# EAGLE design TXV2 (EAGLE 7.3.0)
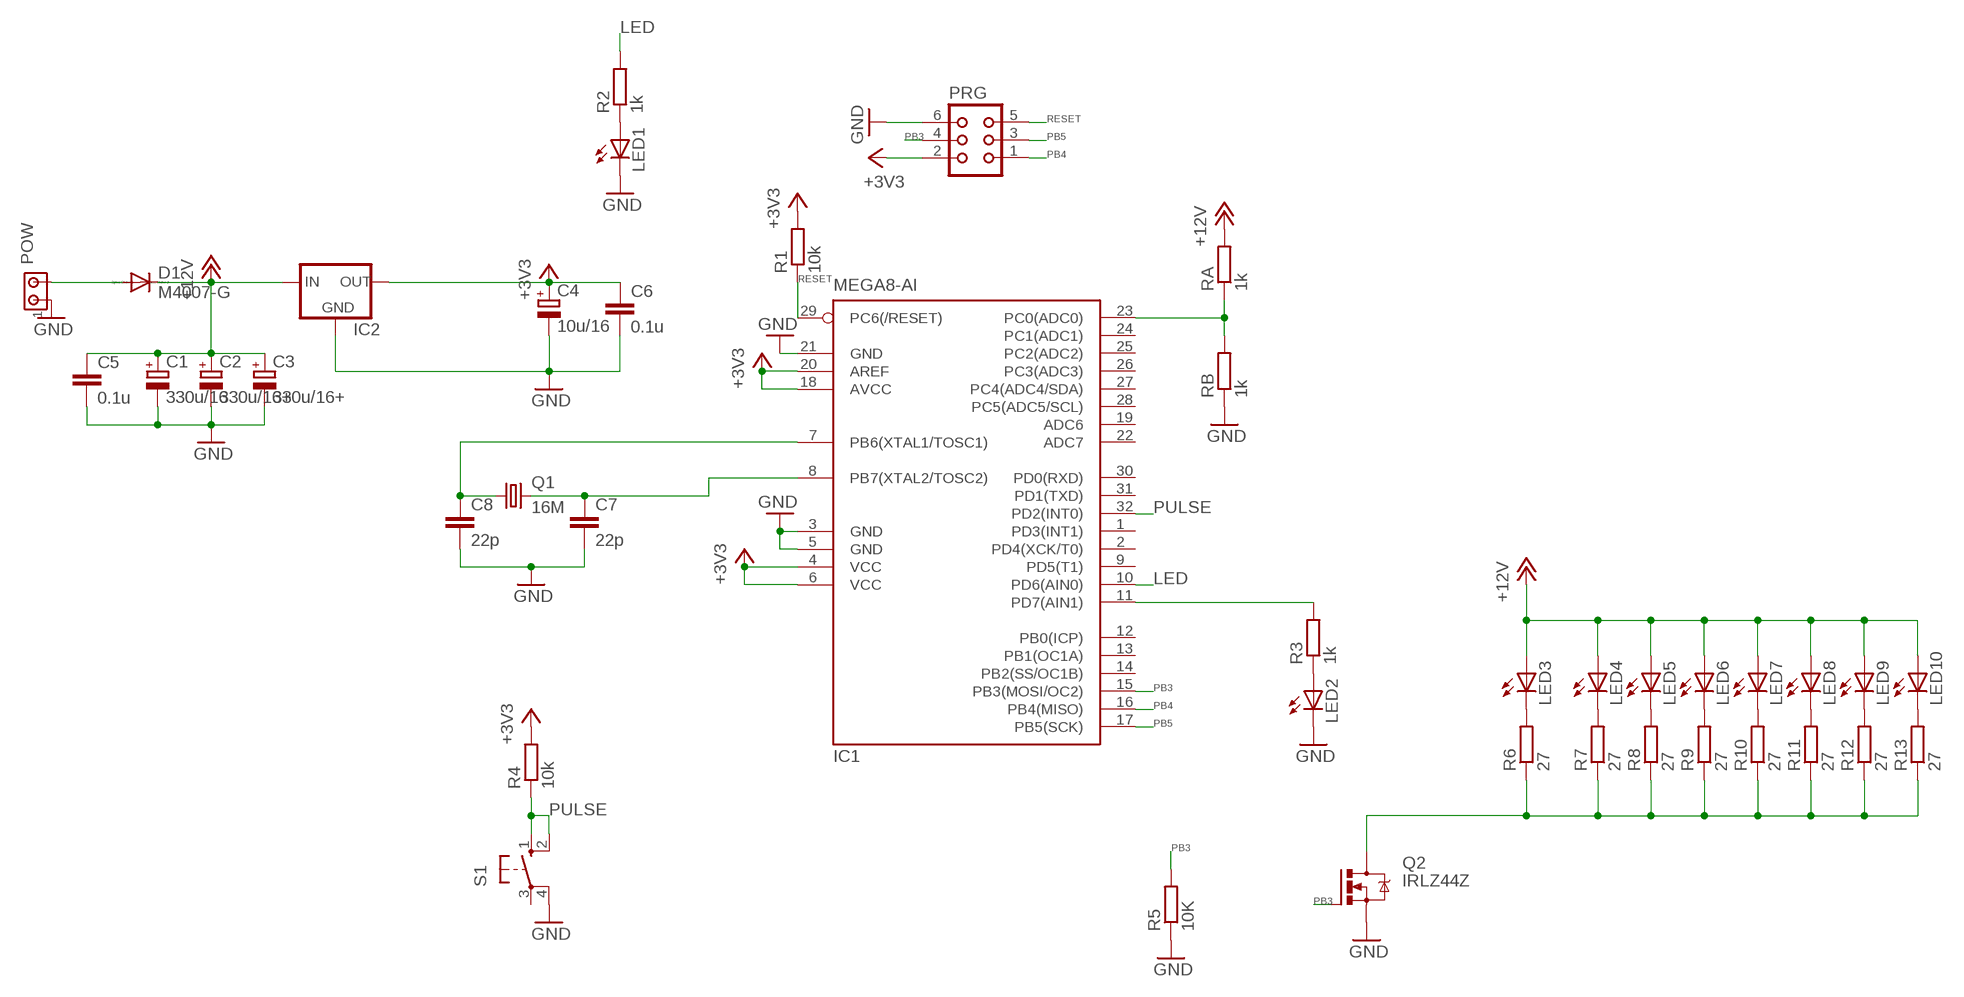
[diagram p0: schematic, sheet 1]

## Parts
C1  330u/16  CPOL-EUE2.5-7  [E2,5-7]
C2  330u/16+  CPOL-EUE2.5-7  [E2,5-7]
C3  330u/16+  CPOL-EUE2.5-7  [E2,5-7]
C4  10u/16  CPOL-EUE2.5-6  [E2,5-6]
C5  0.1u  C-EUC0402  [C0402]
C6  0.1u  C-EUC0402  [C0402]
C7  22p  C-EUC0805  [C0805]
C8  22p  C-EUC0805  [C0805]
D1  M4007-G  CGRM4007-G  [SOD-123_MINI-SMA]
IC1  MEGA8-AI  [TQFP32-08]
IC2  78LXX  [78LXX]
LED1  LED5MM  [LED5MM]
LED2  LED5MM  [LED5MM]
LED3  LED5MM  [LED5MM]
LED4  LED5MM  [LED5MM]
LED5  LED5MM  [LED5MM]
LED6  LED5MM  [LED5MM]
LED7  LED5MM  [LED5MM]
LED8  LED5MM  [LED5MM]
LED9  LED5MM  [LED5MM]
LED10  LED5MM  [LED5MM]
POW  MTA02-100  [10X02MTA]
PRG  CON06  [CON06]
Q1  16M  CRYSTALHC49UP  [HC49UP]
Q2  IRLZ44Z  [TO220BH]
R1  10k  R-EU_M1206  [M1206]
R2  1k  R-EU_M1206  [M1206]
R3  1k  R-EU_M1206  [M1206]
R4  10k  R-EU_M1206  [M1206]
R5  10K  R-EU_M1206  [M1206]
R6  27  R-EU_0204/7  [0204/7]
R7  27  R-EU_0204/7  [0204/7]
R8  27  R-EU_0204/7  [0204/7]
R9  27  R-EU_0204/7  [0204/7]
R10  27  R-EU_0204/7  [0204/7]
R11  27  R-EU_0204/7  [0204/7]
R12  27  R-EU_0204/7  [0204/7]
R13  27  R-EU_0204/7  [0204/7]
RA  1k  R-EU_M1206  [M1206]
RB  1k  R-EU_M1206  [M1206]
S1  10-XX  [B3F-10XX]

## Nets
+3V3: C4.+ C6.1 IC1.4(VCC) IC1.6(VCC) IC1.18(AVCC) IC1.20(AREF) IC2.OUT PRG.2 R1.2 R4.2
+12V: C1.+ C2.+ C3.+ C5.1 D1.C IC2.IN LED3.A LED4.A LED5.A LED6.A LED7.A LED8.A LED9.A LED10.A RA.2
GND: C1.- C2.- C3.- C4.- C5.2 C6.2 C7.2 C8.2 IC1.3(GND) IC1.5(GND) IC1.21(GND) IC2.GND LED1.K(C) LED2.K(C) POW.1 PRG.6 Q2.S R5.1 RB.1 S1.4(P1)
LED: IC1.10(PD6(AIN0)) R2.2
N$1: LED3.K(C) R6.2
N$2: LED1.A R2.1
N$3: IC1.11(PD7(AIN1)) R3.2
N$4: LED2.A R3.1
N$5: LED4.K(C) R7.2
N$6: C8.1 IC1.7(PB6(XTAL1/TOSC1)) Q1.1
N$7: C7.1 IC1.8(PB7(XTAL2/TOSC2)) Q1.2
N$8: LED5.K(C) R8.2
N$9: LED6.K(C) R9.2
N$10: LED7.K(C) R10.2
N$11: LED8.K(C) R11.2
N$12: LED9.K(C) R12.2
N$13: LED10.K(C) R13.2
N$14: IC1.23(PC0(ADC0)) RA.1 RB.2
N$15: Q2.D R6.1 R7.1 R8.1 R9.1 R10.1 R11.1 R12.1 R13.1
N$16: D1.A POW.2
PB3: IC1.15(PB3(MOSI/OC2)) PRG.4 Q2.G R5.2
PB4: IC1.16(PB4(MISO)) PRG.1
PB5: IC1.17(PB5(SCK)) PRG.3
PULSE: IC1.32(PD2(INT0)) R4.1 S1.1(S) S1.2(S1)
RESET: IC1.29(PC6(/RESET)) PRG.5 R1.1
Unconnected: IC1.1(PD3(INT1)) IC1.2(PD4(XCK/T0)) IC1.9(PD5(T1)) IC1.12(PB0(ICP)) IC1.13(PB1(OC1A)) IC1.14(PB2(SS/OC1B)) IC1.19(ADC6) IC1.22(ADC7) IC1.24(PC1(ADC1)) IC1.25(PC2(ADC2)) IC1.26(PC3(ADC3)) IC1.27(PC4(ADC4/SDA)) IC1.28(PC5(ADC5/SCL)) IC1.30(PD0(RXD)) IC1.31(PD1(TXD)) S1.3(P)

## Library data of the parts
C1-C4 = rcl:CPOL-EU: POLARIZED CAPACITOR, European symbol
C5-C8 = rcl:C-EU: CAPACITOR, European symbol
D1 = diode:CGRM400*-G: Molded plasitc,JEDEC SOD-123/Mini SMA Source: Comchip CGRM4001-G.pdf
IC1 = atmel:MEGA8: MICROCONTROLLER 8 Kbytes FLASH, 1 kbytes SRAM, 512 bytes EEPROM, USART, 6-channel 10 bit ADC, 2-channel 8 bit ADC Pin compatible with Atmega48, ATMega88, ATMega168 Source: avr.lbr; MPN: ATMEGA8-16AU; OC_FARNELL: 9171371; OC_NEWARK: 73M8863
IC2 = v-reg:78LXX: VOLTAGE REGULATOR
LED1-LED10 = led:LED: LED OSRAM: - CHIPLED LG R971, LG N971, LY N971, LG Q971, LY Q971, LO R971, LY R971 LH N974, LH R974 LS Q976, LO Q976, LY Q976 LO Q996 - Hyper CHIPLED LW Q18S LB Q993, LB Q99A, LB R99A - SideLED LS A670, LO A670, LY A670, LG A670, LP A670 LB A673, LV A673, LT A673, LW A673 LH A674 LY A675 LS A676, LA A676, LO A676, LY A676, LW A676 LS A679, LY A679, LG A679 - Hyper Micro SIDELED® LS Y876, LA Y876, LO Y876, LY Y876 LT Y87S - SmartLED LW L88C, LW L88S LB L89C, LB L89S, LG L890 LS L89K, LO L89K, LY L89K LS L896, LA L896, LO L896, LY L896 - TOPLED LS T670, LO T670, LY T670, LG T670, LP T670 LSG T670, LSP T670, LSY T670, LOP T670, LYG T670 LG T671, LOG T671, LSG T671 LB T673, LV T673, LT T673, LW T673 LH T674 LS T676, LA T676, LO T676, LY T676, LB T676, LH T676, LSB T676, LW T676 LB T67C, LV T67C, LT T67C, LS T67K, LO T67K, LY T67K, LW E67C LS E67B, LA E67B, LO E67B, LY E67B, LB E67C, LV E67C, LT E67C LW T67C LS T679, LY T679, LG T679 LS T770, LO T770, LY T770, LG T770, LP T770 LB T773, LV T773, LT T773, LW T773 LH T774 LS E675, LA E675, LY E675, LS T675 LS T776, LA T776, LO T776, LY T776, LB T776 LHGB T686 LT T68C, LB T68C - Hyper Mini TOPLED® LB M676 - Mini TOPLED Santana® LG M470 LS M47K, LO M47K, LY M47K Source: http://www.osram.convergy.de LUXEON: - LUMILED® LXK2-PW12-R00, LXK2-PW12-S00, LXK2-PW14-U00, LXK2-PW14-V00 LXK2-PM12-R00, LXK2-PM12-S00, LXK2-PM14-U00 LXK2-PE12-Q00, LXK2-PE12-R00, LXK2-PE12-S00, LXK2-PE14-T00, LXK2-PE14-U00 LXK2-PB12-K00, LXK2-PB12-L00, LXK2-PB12-M00, LXK2-PB14-N00, LXK2-PB14-P00, LXK2-PB14-Q00 LXK2-PR12-L00, LXK2-PR12-M00, LXK2-PR14-Q00, LXK2-PR14-R00 LXK2-PD12-Q00, LXK2-PD12-R00, LXK2-PD12-S00 LXK2-PH12-R00, LXK2-PH12-S00 LXK2-PL12-P00, LXK2-PL12-Q00, LXK2-PL12-R00 Source: www.luxeon.com KINGBRIGHT: KA-3528ASYC Source: www.kingbright.com
POW = con-amp:MTA02-100: AMP connector
PRG = con-harting:CON06: CONNECTOR; OC_FARNELL: unknown; OC_NEWARK: unknown
Q1 = crystal:CRYSTAL: CRYSTAL; OC_FARNELL: unknown; OC_NEWARK: unknown
Q2 = transistor-power:IRLZ44Z: N-Channel HEXFET® Power MOSFET Logic Level AUTOMOTIVE MOSFET Source: http://www.irf.com/product-info/datasheets/data/irlz44zpbf.pdf
R1-R13 RA RB = rcl:R-EU_: RESISTOR, European symbol
S1 = switch-omron:10-XX: OMRON SWITCH; MPN: B3F-1000; OC_FARNELL: 176432; OC_NEWARK: 36M3542

## Board
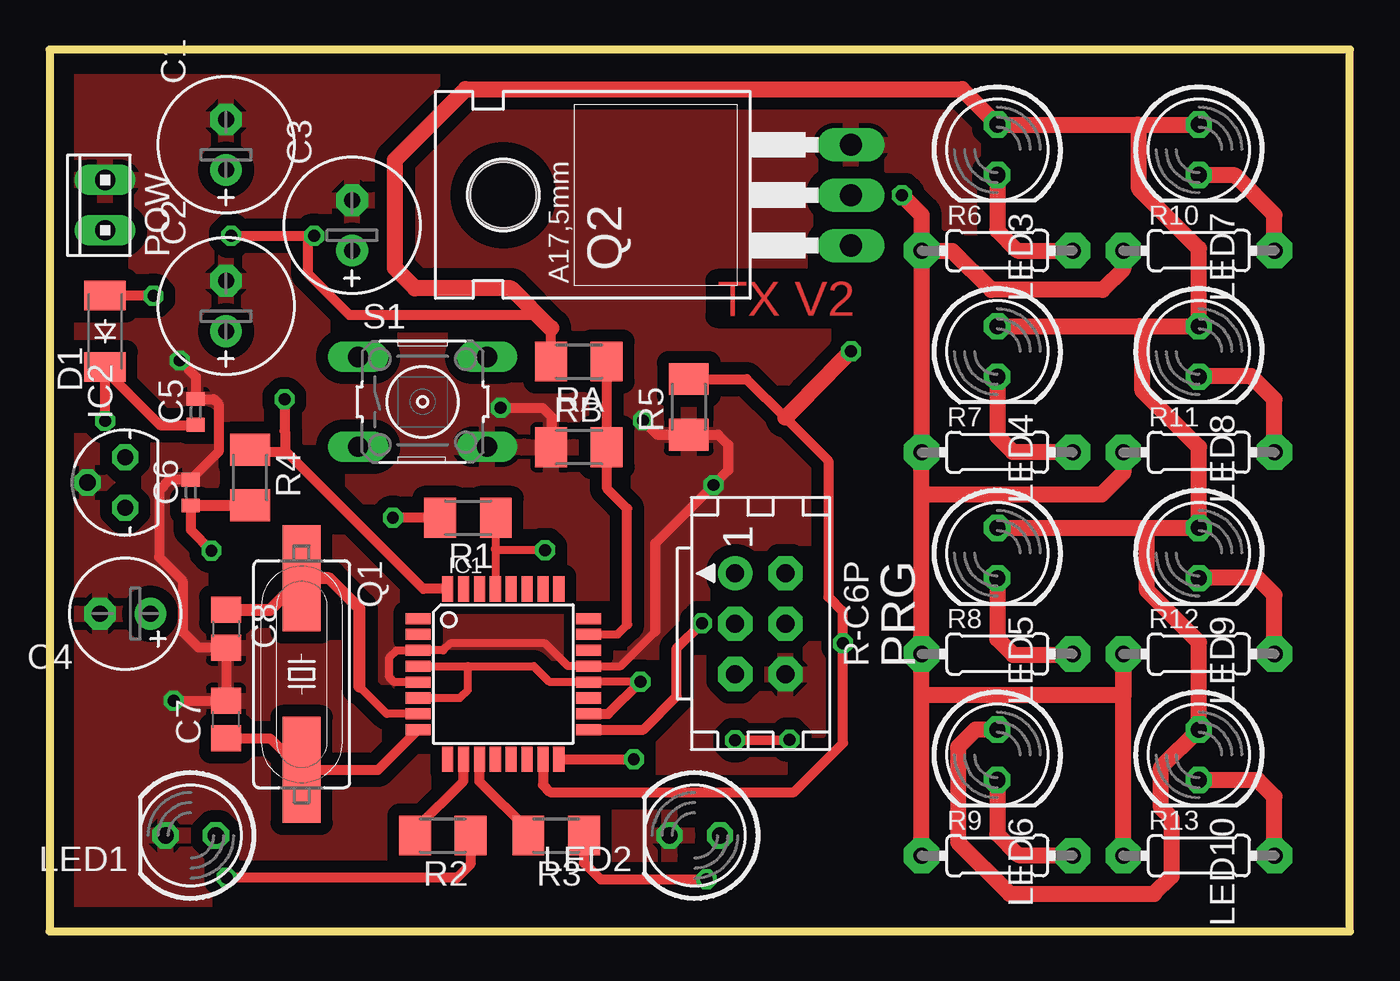
[diagram p1: board, top side]
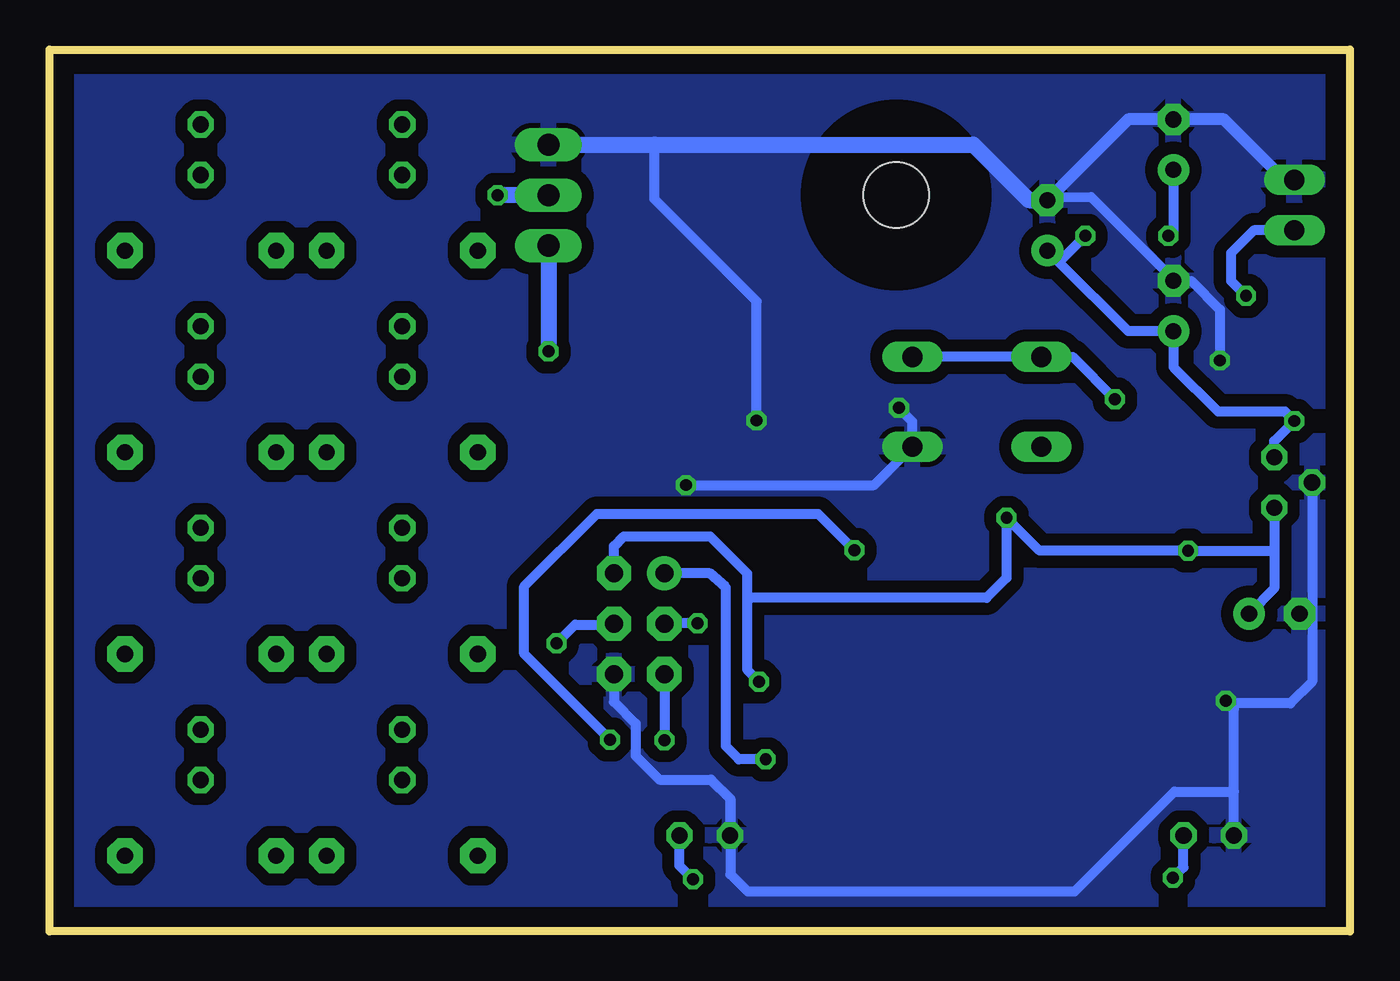
[diagram p2: board, bottom side, seen from below]

Size 65.52 x 44.41 mm. Coordinates in mm from the lower left corner, seen from the top.
Outline: 0,0 65.52,0 65.52,44.41 0,44.41 0,0
Copper layers (1*16): Top 0.035mm / dielectric 1.5mm / Bottom 0.035mm
Design rules "default": minimum track width 10mil, minimum drill 24mil, track to track 8mil, track to pad 8mil, pad to pad 8mil, via to via 8mil, smd to smd 8mil, copper to edge 40mil, drill to drill 8mil, minimum pad ring 10mil, minimum via ring 8mil, stop-mask expansion 4mil, vias tented up to drill 0mil, thermal gap 10mil

### Footprints (pad centres in the part's own frame; a part is rotated, then mirrored left to right if it is on the bottom)
E2,5-7 = drill 0.813 pad 1.6: + -1.27,0 | drill 0.813 pad 1.6 octagon: - 1.27,0
E2,5-6 = drill 0.813 pad 1.6: + -1.27,0 | drill 0.813 pad 1.6 octagon: - 1.27,0
C0402 = smd 0.7 x 0.9: 1 -0.65,0; 2 0.65,0
C0805 = smd 1.3 x 1.5: 1 -0.95,0; 2 0.95,0
SOD-123_MINI-SMA = smd 1.5 x 2.1: A 1.8,0; C -1.8,0
TQFP32-08 = smd 1.27 x 0.559: 1 -4.293,2.8; 2 -4.293,2; 3 -4.293,1.2; 4 -4.293,0.4; 5 -4.293,-0.4; 6 -4.293,-1.2; 7 -4.293,-2; 8 -4.293,-2.8; 17 4.293,-2.8; 18 4.293,-2; 19 4.293,-1.2; 20 4.293,-0.4; 21 4.293,0.4; 22 4.293,1.2; 23 4.293,2; 24 4.293,2.8 | smd 0.559 x 1.27: 9 -2.8,-4.293; 10 -2,-4.293; 11 -1.2,-4.293; 12 -0.4,-4.293; 13 0.4,-4.293; 14 1.2,-4.293; 15 2,-4.293; 16 2.8,-4.293; 25 2.8,4.293; 26 2,4.293; 27 1.2,4.293; 28 0.4,4.293; 29 -0.4,4.293; 30 -1.2,4.293; 31 -2,4.293; 32 -2.8,4.293
78LXX = drill 0.813 octagon: GND 0,1.905; IN 1.27,0; OUT -1.27,0
LED5MM = drill 0.813 octagon: A -1.27,0; K 1.27,0
10X02MTA = drill 1.016 long: 1 1.27,0; 2 -1.27,0
CON06 = drill 0.914 pad 1.727: 1 -2.54,-1.27 | drill 0.914 pad 1.727 octagon: 2 -2.54,1.27; 3 0,-1.27; 4 0,1.27; 5 2.54,-1.27; 6 2.54,1.27
HC49UP = smd 5.334 x 1.93: 1 -4.826,0; 2 4.826,0
TO220BH = drill 1.118 long: D 0,-6.35; G -2.54,-6.35; S 2.54,-6.35 | hole 3.302: 0,11.176
M1206 = smd 1.6 x 2: 1 -1.4,0; 2 1.4,0
0204/7 = drill 0.813 pad 1.778 octagon: 1 -3.81,0; 2 3.81,0
B3F-10XX = drill 1.016 long: 1 -3.251,2.261; 2 3.251,2.261; 3 -3.251,-2.261; 4 3.251,-2.261

### Placement (x,y rotation side)
C1  8.89,39.62 90 top
C2  8.89,31.5 90 top
C3  15.24,35.56 90 top
C4  3.81,16 180 top
C5  7.37,26.16 90 top
C6  7.11,22.1 90 top
C7  8.89,10.67 90 top
C8  8.89,15.24 270 top
D1  2.79,30.23 90 top
IC1  22.86,12.95 0 top
IC2  3.81,22.61 90 top
LED1  7.11,4.83 180 top
LED2  32.51,4.83 180 top
LED3  47.75,39.37 270 top
LED4  47.75,29.21 270 top
LED5  47.75,19.05 270 top
LED6  47.75,8.89 270 top
LED7  57.91,39.37 270 top
LED8  57.91,29.21 270 top
LED9  57.91,19.05 270 top
LED10  57.91,8.89 270 top
POW  2.79,36.58 90 top
PRG  35.81,15.49 270 top
Q1  12.7,12.95 270 top
Q2  34.04,37.08 90 top
R1  21.08,20.83 180 top
R2  19.81,4.83 180 top
R3  25.53,4.83 180 top
R4  10.11,22.86 270 top
R5  32.21,26.42 90 top
R6  47.75,34.29 0 top
R7  47.75,24.13 0 top
R8  47.75,13.97 0 top
R9  47.75,3.81 0 top
R10  57.91,34.29 0 top
R11  57.91,24.13 0 top
R12  57.91,13.97 0 top
R13  57.91,3.81 0 top
RA  26.67,28.7 180 top
RB  26.67,24.38 0 top
S1  18.8,26.67 0 top

### Tracks (layer width: path | path; a pad name or v marks a point on that pad's centre or on a via)
+3V3  (via drill 0.6)
  Top 0.406: v29.77,12.57 27.17,12.57 | IC1.4 21.08,13.35 | 21.08,13.35 24.39,13.35 25.17,12.57 27.13,12.57 | IC1.6 20.67,11.75 21.08,12.17 21.08,13.35
  Top 0.508: 27.17,12.57 IC1.20 27.13,12.57 | IC1.18 28.15,10.95 v29.77,12.57 | 7.11,21.41 C6.1 10.1,21.45 R4.2 7.16,21.46 7.11,21.41 | 7.11,21.41 7.11,20.22 v8.15,19.18 | R1.2 v17.3,20.83
  Bottom 0.508: PRG.2 37.08,19.41 36.6,19.89 32.23,19.89 30.38,18.03 30.38,16.64 | 30.38,16.64 30.38,13.18 v29.77,12.57 | IC2.OUT 3.81,19.18 | 3.81,19.18 3.81,17.27 C4.+ | 3.81,19.18 v8.15,19.18 15.65,19.18 v17.3,20.83 17.3,17.8 18.31,16.79 30.23,16.79 30.38,16.64
+12V  (via drill 0.6)
  Top 0.508: C5.1 7.36,25.5 5.56,25.5 2.79,28.27 D1.C v2.79,25.7 | v9.14,35.03 v13.34,35.03 13.03,34.72 13.03,33.12 15.11,31.04 24.61,31.04 25.27,30.38 RA.2
  Top 0.813: 54.81,40.64 LED3.A 45.97,42.42 20.95,42.42 17.4,38.86 17.4,33.4 18.41,32.38 23.24,32.38 25.25,30.38 25.27,30.38 | 54.81,40.64 LED7.A | LED6.A 46.66,10.16 45.77,9.27 45.77,4.5 48.39,1.88 55.65,1.88 56.54,2.77 56.54,5.69 56.01,6.22 56.01,8.26 LED10.A 57.91,14.55 55.3,17.17 55.3,20.04 55.58,20.32 | LED5.A 55.58,20.32 | 55.58,20.32 LED9.A 57.91,24.38 55.07,27.23 55.07,30.33 54.91,30.48 | LED4.A 54.91,30.48 | 54.91,30.48 LED8.A 57.91,34.39 54.89,37.41 54.89,40.56 54.81,40.64
  Bottom 0.508: 14.66,33.71 11.18,30.23 C2.+ 8.89,28.42 6.66,26.19 3.28,26.19 v2.79,25.7 3.81,24.69 IC2.IN | 14.66,33.71 C3.+ | C1.+ 8.89,35.28 v9.14,35.03 | v13.34,35.03 14.66,33.71
GND  (via drill 0.6)
  Top 0.406: IC1.3 19.84,14.15 20.19,14.5 24.97,14.5 26.12,13.35 IC1.21 28.77,13.35 30.53,15.11 | IC1.5 17.37,12.55 17.12,12.8 17.12,13.79 17.48,14.15 IC1.3
  Top 0.508: IC1.3 | v6.25,11.61 8.88,11.61 C7.2 C8.2 7.49,14.3 6.71,15.09 6.71,17.65 5.51,18.85 5.51,22.2 6.06,22.75 C6.2 8.51,24.14 8.51,26.57 8.27,26.81 C5.2 7.37,27.94 v6.55,28.75 | v22.73,26.36 24.84,26.36 25.3,25.91 25.3,24.41 RB.1 | R5.1 30.61,25.02 | v29.9,25.73 30.61,25.02 | 30.61,25.02 33.68,25.02 34.19,24.51 34.19,23.22 v33.45,22.48 30.53,19.56 30.53,15.11
  Bottom 0.508: PRG.6 37.08,11.56 35.99,10.46 35.99,8.84 34.8,7.64 32.21,7.64 | 32.21,7.64 31.24,6.68 LED2.K | LED1.K 5.84,7.04 | 5.84,7.04 5.84,11.2 v6.25,11.61 6.12,11.48 3,11.48 1.91,12.57 IC2.GND 1.91,16.64 C4.- | C3.- 15.11,36.96 13.03,36.98 8.84,32.79 C2.- 8,32.77 6.55,31.32 v6.55,28.75 | v22.73,26.36 22.05,25.68 S1.4 23.98,22.48 v33.45,22.48 | v29.9,25.73 29.9,31.73 35.05,36.88 35.05,39.6 35.03,39.62 | 32.21,7.64 32.18,7.64 31.22,6.68 31.22,2.87 30.35,2.01 13.87,2.01 8.84,7.04 5.84,7.04
  Bottom 0.61: POW.1 3.3,37.85 6.35,40.89 C1.- 11.18,40.89 C3.-
  Bottom 0.813: Q2.S 35.03,39.62 18.97,39.62 16.18,36.83 C3.-
  pour Top (isolate 0.61): -2.54,45.72 -2.54,0 66.04,0 66.04,45.72
  pour Bottom (isolate 0.61): -2.54,45.72 -2.54,0 66.04,0 66.04,45.72
LED
  Top 0.508: R2.2 18.41,5.13 20.85,7.57 IC1.10
N$1
  Top 0.813: LED3.K 47.75,35.31 48.77,34.29 R6.2
N$2  (via drill 0.6)
  Top 0.508: R2.1 21.21,3.38 20.52,2.69 v8.91,2.69
  Bottom 0.508: v8.91,2.69 8.38,3.23 LED1.A
N$3
  Top 0.508: R3.2 24.13,5.08 21.67,7.54 IC1.11
N$4  (via drill 0.6)
  Top 0.508: R3.1 26.93,3.45 27.76,2.62 v33.1,2.62
  Bottom 0.508: v33.1,2.62 33.78,3.3 LED2.A
N$5
  Top 0.813: LED4.K 47.75,24.94 48.54,24.16 51.54,24.16 R7.2
N$6
  Top 0.406: IC1.7 16.99,10.95 15.62,12.32
  Top 0.61: C8.1 11.11,16.19 Q1.1 14.1,17.78 15.62,16.26 15.62,12.32
N$7
  Top 0.508: IC1.8 16.54,8.13 Q1.2 11.11,9.72 C7.1
N$8
  Top 0.813: LED5.K 47.75,14.73 48.56,13.92 51.51,13.92 R8.2
N$9
  Top 0.813: LED6.K 47.75,4.9 48.82,3.83 51.54,3.83 R9.2
N$10
  Top 0.813: R10.2 61.72,36.09 59.74,38.08 57.94,38.08 LED7.K
N$11
  Top 0.813: R11.2 61.72,26.8 60.55,27.96 57.94,27.96 LED8.K
N$12
  Top 0.813: R12.2 61.72,16.94 60.86,17.8 57.94,17.8 LED9.K
N$13
  Top 0.813: R13.2 61.72,6.78 60.88,7.62 LED10.K
N$14
  Top 0.406: IC1.23 28.62,14.95 29.11,15.44
  Top 0.508: RA.1 RB.2 28.09,24.36 28.09,22.3 29.11,21.29 29.11,15.44
N$15  (via drill 0.6)
  Top 0.813: v42.95,37.08 43.94,36.09 R6.1 | R6.1 R7.1 43.94,22.07 | 43.94,22.07 R8.1 43.94,12.12 | R9.1 43.94,12.12 | R13.1 R12.1 54.1,11.91 54.13,11.89 44.17,11.89 43.94,12.12 | R10.1 54.1,33.35 53.06,32.31 47.45,32.31 45.49,34.27 43.97,34.27 R6.1 | R11.1 54.1,23.09 53.01,22 44.02,22 43.94,22.07
  Bottom 0.813: Q2.D v42.95,37.08
N$16  (via drill 0.6)
  Top 0.508: v5.23,32 2.82,32 D1.A
  Bottom 0.508: POW.2 4.85,35.31 5.99,34.16 5.99,32.77 v5.23,32
PB3  (via drill 0.6)
  Top 0.508: IC1.15 24.86,7.37 25.22,7.01 37.52,7.01 39.98,9.47 v39.98,14.5 39.95,14.53 39.95,16.13 39.24,16.84 39.24,23.7 37.07,25.87 35.12,27.82 R5.2 | 38.2,27.03 38.2,27
  Top 0.813: v40.39,29.21 38.2,27.03 | 38.2,27 37.07,25.87
  Bottom 0.508: v39.98,14.5 39.04,15.44 37.13,15.44 PRG.4
  Bottom 0.813: Q2.G v40.39,29.21
PB4  (via drill 0.6)
  Top 0.508: IC1.16 v29.44,8.66
  Bottom 0.508: 29.41,8.64 v29.44,8.66 30.79,8.66 31.45,9.32 31.45,17.32 32.23,18.03 PRG.1
PB5  (via drill 0.6)
  Top 0.508: IC1.17 29.91,10.15 31.6,11.84 31.6,14.25 v32.87,15.52
  Bottom 0.508: v32.87,15.52 34.52,15.52 PRG.3
PULSE  (via drill 0.6)
  Top 0.508: IC1.32 18.82,17.25 11.94,24.13 | 11.94,24.13 10.04,24.13 R4.1 | v11.84,26.8 11.84,25.2 11.86,25.17 11.86,24.21 11.94,24.13
  Bottom 0.508: S1.2 S1.1 13.97,28.93 v11.84,26.8
RESET  (via drill 0.6)
  Top 0.406: R1.1 22.48,19.25 22.48,17.27 | v24.97,19.2 22.53,19.2
  Top 0.508: 22.48,17.27 IC1.29 | 22.53,19.2 22.48,19.25 | v34.54,9.63 v37.29,9.65
  Bottom 0.508: v24.97,19.2 26.8,21.03 37.95,21.03 41.6,17.37 41.6,13.97 v37.29,9.65 | PRG.5 v34.54,9.63

### Text on the board
Top: TX V2